# EAGLE board SBECU (EAGLE 9.6.2), part 1 of 2
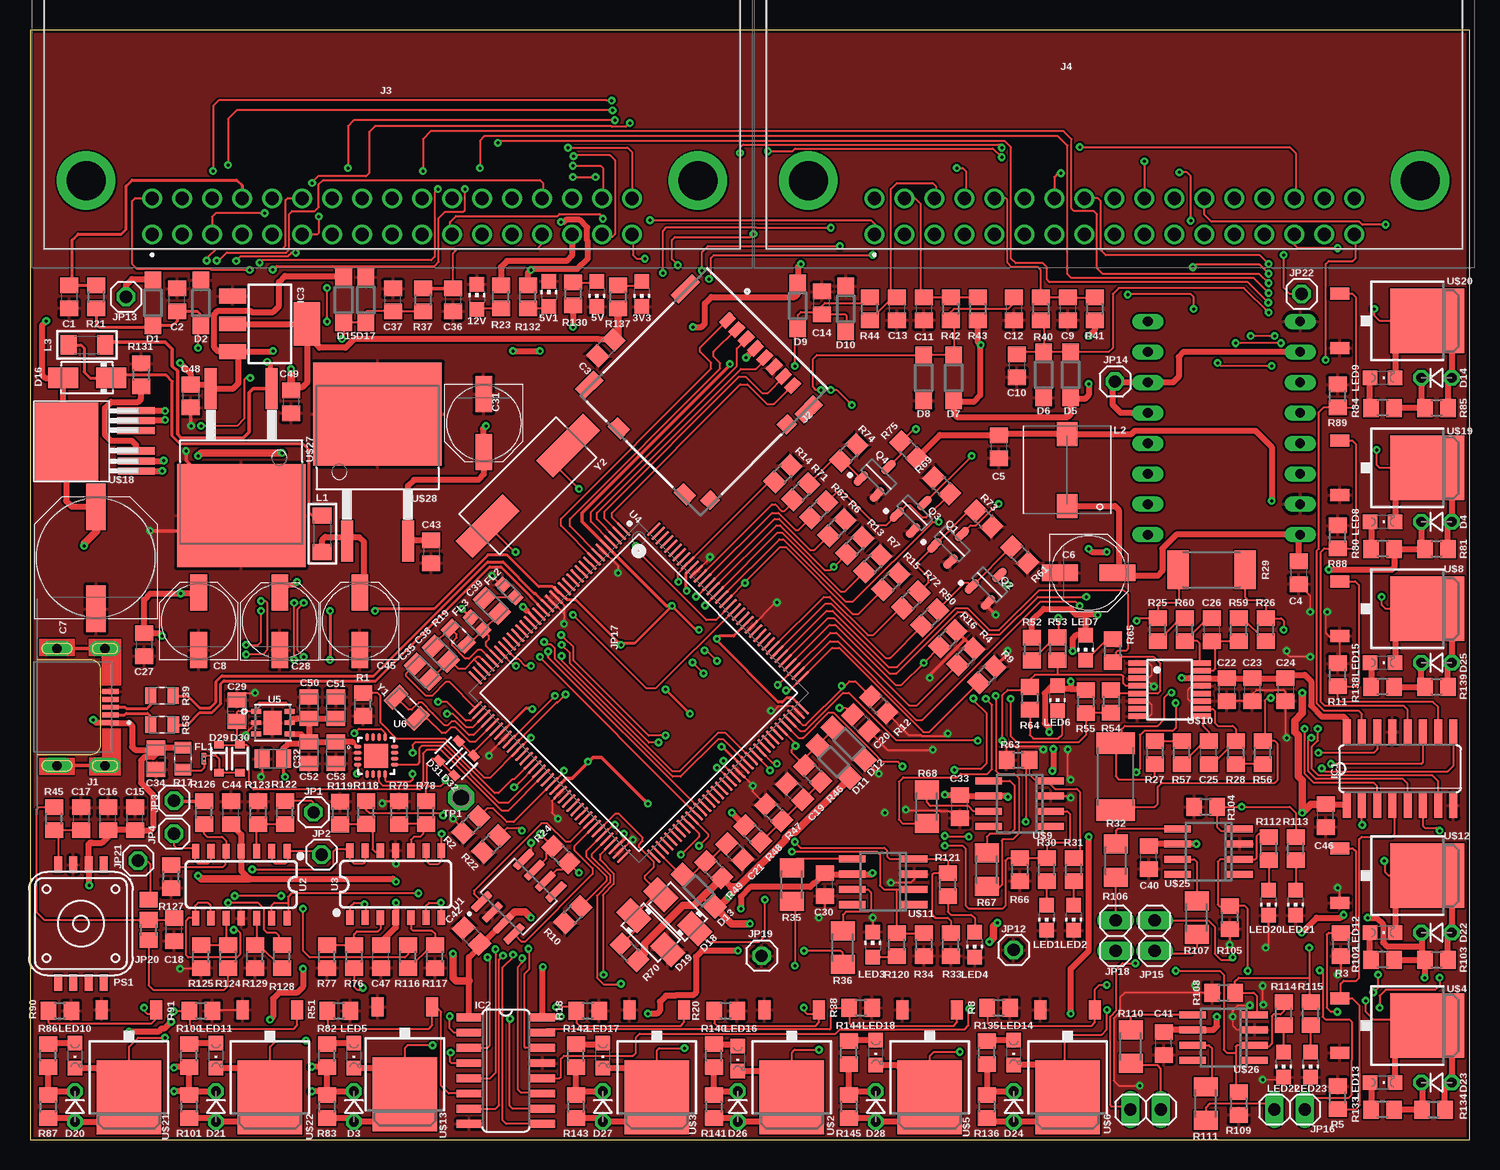
[diagram p5: board, top side]
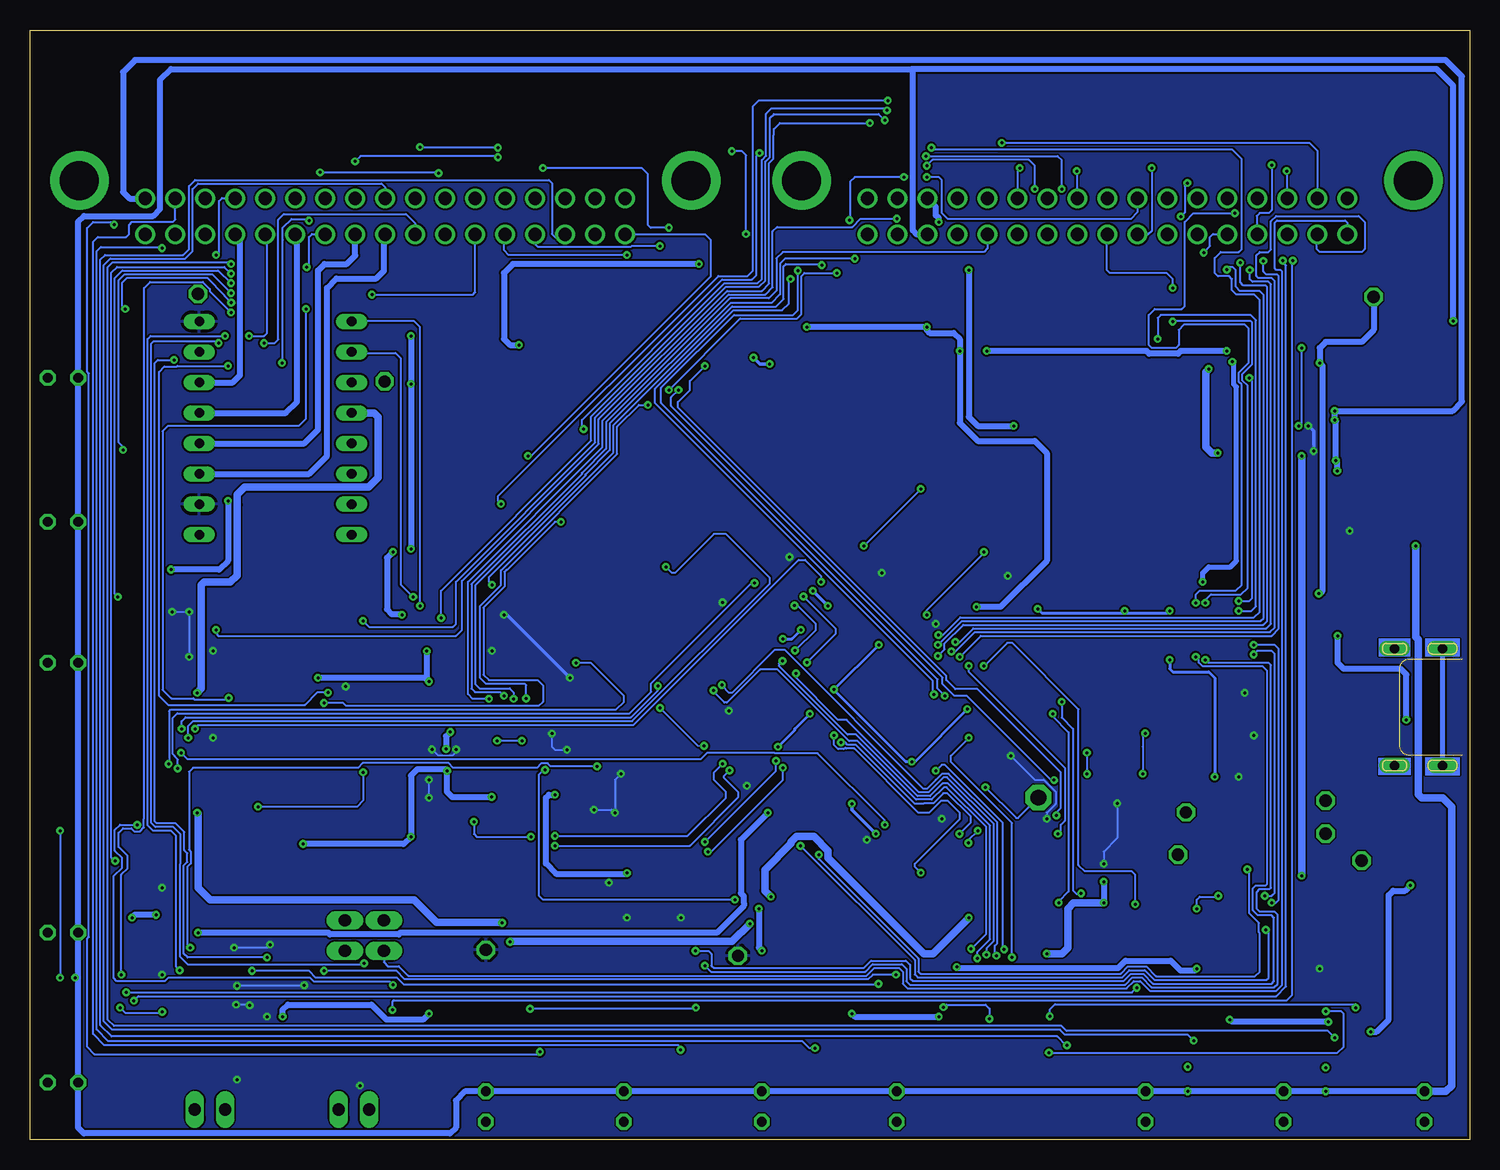
[diagram p6: board, bottom side, seen from below]

Size 120 x 92.5 mm. Coordinates in mm from the lower left corner, seen from the top.
Outline: 0,0 120,0 120,92.5 0,92.5 0,0
Copper layers (1*16): Top 0.035mm / dielectric 1.5mm / Bottom 0.035mm
Design rules "default *": minimum track width 4mil, minimum drill 0.25mm, track to track 6mil, track to pad 6mil, pad to pad 6mil, via to via 6mil, smd to smd 6mil, copper to edge 10mil, drill to drill 6mil, minimum pad ring 10mil, minimum via ring 8mil, stop-mask expansion 4mil, vias tented up to drill 0mil, thermal gap 10mil

## Footprints (pad centres in the part's own frame; a part is rotated, then mirrored left to right if it is on the bottom)
CHIP-LED0805 = smd 1.2 x 1.2: A 0,-1.05; C 0,1.05
C0805 = smd 1.3 x 1.5: 1 -0.95,0; 2 0.95,0
PANASONIC_D = smd 3 x 1.4: + 2.4,0; - -2.4,0
PANASONIC_G = smd 3.9 x 1.6: + 4.25,0; - -4.25,0
CAPC2012X110N = smd 1.24 x 1.56: 1 -0.885,0; 2 0.885,0
CAPC2012X140N = smd 1.24 x 1.56: 1 -0.885,0; 2 0.885,0
CAPC2012X100N = smd 1.24 x 1.56: 1 -0.885,0; 2 0.885,0
SOD123 = smd 1.4 x 1.4: A 1.9,0; C -1.9,0
D-2.5 = drill 0.813 octagon: A 1.27,0; C -1.27,0
DO214AC = smd 2.5 x 1.7: A 2,0; C -2,0
SOD-323 = smd 0.63 x 0.83: A 1.15,0; C -1.15,0
BEADC0603X33N = smd 0.38 x 0.4: 1 -0.281,0; 2 0.281,0
BEADC1608X95N = smd 1 x 0.97: 1 -0.735,0; 2 0.735,0
SO16 = smd 0.66 x 2.032: 1 -4.445,-3.073; 2 -3.175,-3.073; 3 -1.905,-3.073; 4 -0.635,-3.073; 5 0.635,-3.073; 6 1.905,-3.073; 7 3.175,-3.073; 8 4.445,-3.073; 9 4.445,3.073; 10 3.175,3.073; 11 1.905,3.073; 12 0.635,3.073; 13 -0.635,3.073; 14 -1.905,3.073; 15 -3.175,3.073; 16 -4.445,3.073
SOT223 = smd 1.219 x 2.235: 1 -2.311,-3.099; 2 0,-3.099; 3 2.311,-3.099 | smd 3.6 x 2.2: TAB 0,3.099
TE_2134441-2 = smd 1.4 x 0.4: 1 -4.45,1.3; 2 -4.45,0.65; 3 -4.45,0; 4 -4.45,-0.65; 5 -4.45,-1.3 | drill 0.8 pad 1.25 long: S1 -4,-4.875; S2 0,-4.875; S3 0,4.875; S4 -4,4.875
5031821852 = smd 0.8 x 1.24: 1 -2.85,0.63; 2 -1.75,0.63; 3 -0.65,0.63; 4 0.45,0.63; 5 1.55,0.63; 6 2.65,0.63; 7 3.75,0.63; 8 4.85,0.63 | smd 0.95 x 2.5: 9 -7.195,0 | smd 1.15 x 2.2: 10 7.195,0.15; 15 -7.195,-11.33 | smd 1.16 x 1.25: 11 6.795,-2 | smd 1.16 x 1.2: 12 6.74,-11 | smd 1.5 x 1.15: 13 4.89,-12.125; 14 -2.89,-12.125
MX23A34NF1 = drill 1.1 pad 1.65: 1 20,15.5; 2 17.5,15.5; 3 15,15.5; 4 12.5,15.5; 5 10,15.5; 6 7.5,15.5; 7 5,15.5; 8 2.5,15.5; 9 0,15.5; 10 -2.5,15.5; 11 -5,15.5; 12 -7.5,15.5; 13 -10,15.5; 14 -12.5,15.5; 15 -15,15.5; 16 -17.5,15.5; 17 -20,15.5; 18 20,12.5; 19 17.5,12.5; 20 15,12.5; 21 12.5,12.5; 22 10,12.5; 23 7.5,12.5; 24 5,12.5; 25 2.5,12.5; 26 0,12.5; 27 -2.5,12.5; 28 -5,12.5; 29 -7.5,12.5; 30 -10,12.5; 31 -12.5,12.5; 32 -15,12.5; 33 -17.5,12.5; 34 -20,12.5 | drill 3.25 pad 4.875: 35 -25.5,11; 36 25.5,11
1X01 = drill 1.016 octagon: 1 0,0
1X02 = drill 1.016 long: 1 -1.27,0; 2 1.27,0
A0R-JMP = smd 1.5 x 1.3: 1 0,1.7; 2 0,0; 3 0,-1.7
L1206 = smd 1.3 x 1.6: 1 -1.524,0; 2 1.524,0
WE-PD_7332/7345_PLASTIC_BASE = smd 1.7 x 2: 1 0,3; 2 0,-3
CHIPLED_0805 = smd 1.2 x 1.2: A 0,-1.05; C 0,1.05
1317A = smd 1.346 x 0.686: 1 4.915,-1.905; 2 4.915,-0.635; 3 4.915,0.635; 4 4.915,1.905; 5 -4.915,1.905; 6 -4.915,0.635; 7 -4.915,-0.635; 8 -4.915,-1.905
SOT95P280X135-3N = smd 1.4 x 0.65: 1 -1.15,0.95; 2 -1.15,-0.95; 3 1.15,0
R0805 = smd 1.3 x 1.5: 1 -0.95,0; 2 0.95,0
RESC2012X65N = smd 0.97 x 1.38: 1 -0.93,0; 2 0.93,0
RESC2012X60N = smd 0.92 x 1.38: 1 -0.955,0; 2 0.955,0
R2512 = smd 1.8 x 3.2: 1 -2.8,0; 2 2.8,0
M1206 = smd 1.6 x 2: 1 -1.4,0; 2 1.4,0
STEP-STICK = drill 0.8 long: 1A -8.89,-7.62; 1B -8.89,-5.08; 2A -8.89,-2.54; 2B -8.89,0; DIR 3.81,-12.7; EN 3.81,5.08; GND -8.89,-12.7; GNDM -8.89,2.54; MS1 3.81,2.54; MS2 3.81,0; MS3 3.81,-2.54; RST 3.81,-5.08; SLP 3.81,-7.62; SPT 3.81,-10.16; VCC -8.89,-10.16; VMOT -8.89,5.08
P1-13 = drill 1.321 pad 2.159 octagon: TP 0,0
SOIC127P600X175-8N = smd 1.97 x 0.6: 1 -2.475,1.905; 2 -2.475,0.635; 3 -2.475,-0.635; 4 -2.475,-1.905; 5 2.475,-1.905; 6 2.475,-0.635; 7 2.475,0.635; 8 2.475,1.905
SO14 = smd 0.6 x 1.2: 1 -3.175,-2.8; 2 -1.905,-2.8; 3 -0.635,-2.8; 4 0.635,-2.8; 5 1.905,-2.8; 6 3.175,-2.8; 7 4.445,-2.8; 8 4.445,2.8; 9 3.175,2.8; 10 1.905,2.8; 11 0.635,2.8; 12 -0.635,2.8; 13 -1.905,2.8; 14 -3.175,2.8
FREESCALE_SEMICONDUCTOR_MK64FX512VLQ12_0 = smd 1.55 x 0.25: 1 -10.525,8.75; 2 -10.525,8.25; 3 -10.525,7.75; 4 -10.525,7.25; 5 -10.525,6.75; 6 -10.525,6.25; 7 -10.525,5.75; 8 -10.525,5.25; 9 -10.525,4.75; 10 -10.525,4.25; 11 -10.525,3.75; 12 -10.525,3.25; 13 -10.525,2.75; 14 -10.525,2.25; 15 -10.525,1.75; 16 -10.525,1.25; 17 -10.525,0.75; 18 -10.525,0.25; 19 -10.525,-0.25; 20 -10.525,-0.75; 21 -10.525,-1.25; 22 -10.525,-1.75; 23 -10.525,-2.25; 24 -10.525,-2.75; 25 -10.525,-3.25; 26 -10.525,-3.75; 27 -10.525,-4.25; 28 -10.525,-4.75; 29 -10.525,-5.25; 30 -10.525,-5.75; 31 -10.525,-6.25; 32 -10.525,-6.75; 33 -10.525,-7.25; 34 -10.525,-7.75; 35 -10.525,-8.25; 36 -10.525,-8.75; 73 10.525,-8.75; 74 10.525,-8.25; 75 10.525,-7.75; 76 10.525,-7.25; 77 10.525,-6.75; 78 10.525,-6.25; 79 10.525,-5.75; 80 10.525,-5.25; 81 10.525,-4.75; 82 10.525,-4.25; 83 10.525,-3.75; 84 10.525,-3.25; 85 10.525,-2.75; 86 10.525,-2.25; 87 10.525,-1.75; 88 10.525,-1.25; 89 10.525,-0.75; 90 10.525,-0.25; 91 10.525,0.25; 92 10.525,0.75; 93 10.525,1.25; 94 10.525,1.75; 95 10.525,2.25; 96 10.525,2.75; 97 10.525,3.25; 98 10.525,3.75; 99 10.525,4.25; 100 10.525,4.75; 101 10.525,5.25; 102 10.525,5.75; 103 10.525,6.25; 104 10.525,6.75; 105 10.525,7.25; 106 10.525,7.75; 107 10.525,8.25; 108 10.525,8.75 | smd 0.25 x 1.55: 37 -8.75,-10.525; 38 -8.25,-10.525; 39 -7.75,-10.525; 40 -7.25,-10.525; 41 -6.75,-10.525; 42 -6.25,-10.525; 43 -5.75,-10.525; 44 -5.25,-10.525; 45 -4.75,-10.525; 46 -4.25,-10.525; 47 -3.75,-10.525; 48 -3.25,-10.525; 49 -2.75,-10.525; 50 -2.25,-10.525; 51 -1.75,-10.525; 52 -1.25,-10.525; 53 -0.75,-10.525; 54 -0.25,-10.525; 55 0.25,-10.525; 56 0.75,-10.525; 57 1.25,-10.525; 58 1.75,-10.525; 59 2.25,-10.525; 60 2.75,-10.525; 61 3.25,-10.525; 62 3.75,-10.525; 63 4.25,-10.525; 64 4.75,-10.525; 65 5.25,-10.525; 66 5.75,-10.525; 67 6.25,-10.525; 68 6.75,-10.525; 69 7.25,-10.525; 70 7.75,-10.525; 71 8.25,-10.525; 72 8.75,-10.525; 109 8.75,10.525; 110 8.25,10.525; 111 7.75,10.525; 112 7.25,10.525; 113 6.75,10.525; 114 6.25,10.525; 115 5.75,10.525; 116 5.25,10.525; 117 4.75,10.525; 118 4.25,10.525; 119 3.75,10.525; 120 3.25,10.525; 121 2.75,10.525; 122 2.25,10.525; 123 1.75,10.525; 124 1.25,10.525; 125 0.75,10.525; 126 0.25,10.525; 127 -0.25,10.525; 128 -0.75,10.525; 129 -1.25,10.525; 130 -1.75,10.525; 131 -2.25,10.525; 132 -2.75,10.525; 133 -3.25,10.525; 134 -3.75,10.525; 135 -4.25,10.525; 136 -4.75,10.525; 137 -5.25,10.525; 138 -5.75,10.525; 139 -6.25,10.525; 140 -6.75,10.525; 141 -7.25,10.525; 142 -7.75,10.525; 143 -8.25,10.525; 144 -8.75,10.525
DFN300X300X80-7N = smd 0.813 x 0.406: 1 -1.397,0.94; 2 -1.397,0; 3 -1.397,-0.94; 4 1.397,-0.94; 5 1.397,0; 6 1.397,0.94 | smd 1.499 x 2.007: 7 -0.025,-0.025
QFN50P300X300X65-17N = smd 0.65 x 0.3: 1 -1.55,0.75; 2 -1.55,0.25; 3 -1.55,-0.25; 4 -1.55,-0.75; 9 1.55,-0.75; 10 1.55,-0.25; 11 1.55,0.25; 12 1.55,0.75 | smd 0.3 x 0.65: 5 -0.75,-1.55; 6 -0.25,-1.55; 7 0.25,-1.55; 8 0.75,-1.55; 13 0.75,1.55; 14 0.25,1.55; 15 -0.25,1.55; 16 -0.75,1.55 | smd 2 x 2: 17 0,0
DPAK_N-CHANNEL_MOSFET = smd 5.4 x 6.2: D 0,1.23 | smd 1 x 1.6: G -2.28,-6.07; S 2.28,-6.07
SO-8 = smd 0.6 x 2.2: 1 -1.905,-2.6; 2 -0.635,-2.6; 3 0.635,-2.6; 4 1.905,-2.6; 5 1.905,2.6; 6 0.635,2.6; 7 -0.635,2.6; 8 -1.905,2.6
QSOP16 = smd 0.45 x 1.5: 1 -2.223,-2.69; 2 -1.587,-2.69; 3 -0.953,-2.69; 4 -0.318,-2.69; 5 0.318,-2.69; 6 0.953,-2.69; 7 1.587,-2.69; 8 2.223,-2.69; 9 2.223,2.69; 10 1.587,2.69; 11 0.953,2.69; 12 0.318,2.69; 13 -0.318,2.69; 14 -0.953,2.69; 15 -1.587,2.69; 16 -2.223,2.69
VN5R003H-E_HPAK_TO267_7 = smd 0.6 x 3.1: 1 -2.53,1.65; 2 -1.68,1.65; 3 -0.83,1.66; 5 0.85,1.67; 6 1.68,1.67; 7 2.53,1.67 | smd 6.5 x 5.3: 4 -0.05,7.45
TO263-3 = smd 1 x 3.4: 1 -2.54,-6.6; 3 2.54,-6.6 | smd 10.7 x 8.6: TAB 0,4
XTAL_ABS07-32.768KHZ-T = smd 1.1 x 1.9: 1 -1.25,0; 2 1.25,0
XTAL_ECS-160-20-5P-DN-TR = smd 5.5 x 2: 1 -4.75,0; 2 4.75,0

## Placement (x,y rotation side)
3V3  [CHIP-LED0805]  51,70.5 180 top
5V  [CHIP-LED0805]  47.25,70.5 180 top
5V1  [CHIP-LED0805]  43.25,70.5 0 top
12V  [CHIP-LED0805]  37.25,70.25 0 top
C1  100nF  [C0805]  3.25,70.25 270 top
C2  220nF  [C0805]  12.25,70 90 top
C3  100nF  [C0805]  48,66 225 top
C4  100nF 50V  [C0805]  105.75,47.25 270 top
C5  100nF 50V  [C0805]  80.75,57.75 270 top
C6  100uF 35V  [PANASONIC_D]  88.25,47.25 0 top
C7  470uF 50V  [PANASONIC_G]  5.5,48.5 90 top
C8  220uF  [PANASONIC_D]  14.07,43.22 90 top
C9  100nF  [C0805]  86.5,69.25 270 top
C10  220nF  [C0805]  82.25,64.5 270 top
C11  100nF  [C0805]  74.5,69.25 270 top
C12  220nF  [C0805]  82,69.25 270 top
C13  100nF  [C0805]  72.25,69.25 270 top
C14  220nF  [C0805]  66,69.75 90 top
C15  1uF  [C0805]  8.75,26.75 90 top
C16  100nF  [C0805]  6.5,26.75 90 top
C17  100nF  [C0805]  4.25,26.75 270 top
C18  220nF  [C0805]  12,17.5 90 top
C19  100nF  [C0805]  63.75,29 135 top
C20  220nF  [C0805]  69.25,34.75 315 top
C21  4.7nF  [C0805]  58.75,24 315 top
C22  10nF  [C0805]  99.75,37.5 270 top
C23  100nF  [C0805]  101.88,37.5 270 top
C24  1uF  [C0805]  104.66,37.5 270 top
C25  1nF  [C0805]  98.25,32.25 90 top
C26  1nF  [C0805]  98.5,42.5 270 top
C27  1uF  [C0805]  9.5,41.25 270 top
C28  220uF  [PANASONIC_D]  20.83,43.21 90 top
C29  C0805X104K1REC  [CAPC2012X110N]  17.25,35.75 270 top
C30  1uF  [C0805]  66.25,21.25 90 top
C31  220uF  [PANASONIC_D]  37.83,59.73 270 top
C32  C0805X225J4REC  [CAPC2012X140N]  20.25,31.75 180 top
C33  1uF  [C0805]  77.5,27.75 90 top
C34  C0805X225J4REC  [CAPC2012X140N]  10.5,31.75 90 top
C35  C0805X104K1REC  [CAPC2012X110N]  32.75,39 135 top
C36  100nF  [C0805]  35.25,70 270 top
C37  220nF  [C0805]  30.25,70 90 top
C38  C0805X104K1REC  [CAPC2012X110N]  34.25,40.5 135 top
C39  C0805X225J4REC  [CAPC2012X140N]  38.5,44.5 135 top
C40  1uF  [C0805]  93.25,23.5 90 top
C41  1uF  [C0805]  94.5,8 90 top
C42  100nF  [C0805]  36.81,16.96 135 top
C43  1uF  [C0805]  33.45,49 270 top
C44  100nF  [C0805]  16.75,27.25 90 top
C45  220uF  [PANASONIC_D]  27.5,43.22 90 top
C46  100nF  [C0805]  108,27 90 top
C47  100nF  [C0805]  29.25,15.25 90 top
C48  10uF  [C0805]  13.39,61.99 270 top
C49  10uF  [C0805]  21.75,61.5 270 top
C50  C0805X104K1REC  [CAPC2012X110N]  23.25,36 270 top
C51  C0805X103MMGEC  [CAPC2012X100N]  25.5,36 270 top
C52  C0805X103MMGEC  [CAPC2012X100N]  23.25,32.25 90 top
C53  C0805X225J4REC  [CAPC2012X140N]  25.5,32.25 90 top
D1  1N5819HW-7-F  [SOD123]  10.25,69.75 270 top
D2  1N5819HW-7-F  [SOD123]  14.25,69.75 90 top
D3  1N4001  [D-2.5]  27,2.75 270 top
D4  1N4001  [D-2.5]  117.25,51.5 0 top
D5  1N5819HW-7-F  [SOD123]  86.75,63.75 90 top
D6  1N5819HW-7-F  [SOD123]  84.5,63.75 270 top
D7  1N5819HW-7-F  [SOD123]  77,63.5 90 top
D8  1N5819HW-7-F  [SOD123]  74.5,63.5 270 top
D9  1N5819HW-7-F  [SOD123]  64,69.5 270 top
D10  1N5819HW-7-F  [SOD123]  68,69.25 90 top
D11  1N5819  [SOD123]  67,31.5 135 top
D12  1N5819  [SOD123]  68.25,33 315 top
D13  1N5819HW-7-F  [SOD123]  55.75,20.75 135 top
D14  1N4001  [D-2.5]  117.25,63.5 0 top
D15  1N5819HW-7-F  [SOD123]  26.15,70 270 top
D16  B340A 3A  [DO214AC]  4.75,63.5 180 top
D17  1N5819HW-7-F  [SOD123]  28,70 90 top
D18  1N4001 SMA  [DO214AC]  54,19 135 top
D19  1N4001 SMA  [DO214AC]  51.75,17.25 315 top
D20  1N4001  [D-2.5]  3.75,2.75 270 top
D21  1N4001  [D-2.5]  15.5,2.75 270 top
D22  1N4001  [D-2.5]  117.25,17.25 0 top
D23  1N4001  [D-2.5]  117.25,4.75 0 top
D24  1N4001  [D-2.5]  82,2.75 270 top
D25  1N4001  [D-2.5]  117.25,39.75 0 top
D26  1N4001  [D-2.5]  59,2.75 270 top
D27  1N4001  [D-2.5]  47.75,2.75 270 top
D28  1N4001  [D-2.5]  70.5,2.75 270 top
D29  BAT20JFILM  [SOD-323]  15.75,31.75 270 top
D30  BAT20JFILM  [SOD-323]  17.5,31.75 270 top
D31  BAT20JFILM  [SOD-323]  34.92,32.41 225 top
D32  BAT20JFILM  [SOD-323]  36.19,31.17 225 top
FL1  BLM03AX121SN1D  [BEADC0603X33N]  14.5,31.75 90 top
FL2  BLM18DN601SH1D  [BEADC1608X95N]  39.93,45.73 135 top
FL3  BLM18DN601SH1D  [BEADC1608X95N]  37.26,43 135 top
IC1  4504D  [SO16]  114.21,30.92 0 top
IC2  4504D  [SO16]  39.67,5.74 270 top
IC3  LM1117IMPX-3.3  [SOT223]  20,68 270 top
J1  2134441-2  [TE_2134441-2]  2.25,36.05 180 top
J2  503182-1852  [5031821852]  59.71,65.84 315 top
J3  MX23A34NF1  [MX23A34NF1]  30.18,90.95 180 top
J4  MX23A34NF1  [MX23A34NF1]  90.39,90.95 180 top
JP1  [1X01]  23.64,27.28 0 top
JP2  [1X01]  24.3,23.75 0 top
JP3  [1X01]  12,28.25 0 top
JP4  [1X01]  12,25.5 0 top
JP12  [1X01]  82,15.8 0 top
JP13  [1X01]  8,70.25 0 top
JP14  [1X01]  90.44,63.2 0 top
JP15  [1X02]  93.75,17 90 top
JP16  [1X02]  105,2.5 0 top
JP17  [1X02]  93,2.5 0 top
JP18  [1X02]  90.5,17 90 top
JP19  [1X01]  60.99,15.31 0 top
JP20  0R-JUMPA  [A0R-JMP]  9.89,18.31 180 top
JP21  [1X01]  9,23.25 0 top
JP22  [1X01]  106,70.5 0 top
L1  600R 2A  [L1206]  24.36,50.5 90 top
L2  8.2uH 2.7A  [WE-PD_7332/7345_PLASTIC_BASE]  86.44,55.82 180 top
L3  600R 2A  [L1206]  4.75,66.25 180 top
LED1  [CHIP-LED0805]  84.75,18.5 180 top
LED2  [CHIP-LED0805]  87,18.5 180 top
LED3  [CHIP-LED0805]  70.25,16.25 0 top
LED4  [CHIP-LED0805]  78.75,16.25 180 top
LED5  [CHIPLED_0805]  27,7 180 top
LED6  [CHIP-LED0805]  85.65,36.79 180 top
LED7  [CHIP-LED0805]  88,41 180 top
LED8  [CHIPLED_0805]  112.75,51.5 270 top
LED9  [CHIPLED_0805]  112.75,63.5 270 top
LED10  [CHIPLED_0805]  3.75,7 180 top
LED11  [CHIPLED_0805]  15.5,7 180 top
LED12  [CHIPLED_0805]  112.75,17.25 270 top
LED13  [CHIPLED_0805]  112.75,4.75 270 top
LED14  [CHIPLED_0805]  82,7.25 180 top
LED15  [CHIPLED_0805]  112.75,39.75 270 top
LED16  [CHIPLED_0805]  59,6.75 180 top
LED17  [CHIPLED_0805]  47.75,7 180 top
LED18  [CHIPLED_0805]  70.5,7.25 180 top
LED20  [CHIP-LED0805]  103.25,19.75 180 top
LED21  [CHIP-LED0805]  105.5,19.75 180 top
LED22  [CHIP-LED0805]  104.5,6.25 180 top
LED23  [CHIP-LED0805]  106.75,6.25 180 top
PS1  MPXH6400AC6T1  [1317A]  4.25,18 90 top
Q1  IRLML0030TRPBF  [SOT95P280X135-3N]  76.88,49.67 45 top
Q2  IRLML0030TRPBF  [SOT95P280X135-3N]  80,46.25 45 top
Q3  IRLML0030TRPBF  [SOT95P280X135-3N]  73.75,52.25 45 top
Q4  IRLML0030TRPBF  [SOT95P280X135-3N]  70.75,55.25 45 top
R1  10K  [R0805]  27.75,36.26 90 top
R2  10K  [R0805]  36.75,26.25 45 top
R3  68K  [R0805]  109.26,16.25 270 top
R4  10K  [R0805]  78,40.25 225 top
R5  68K  [R0805]  109,3.5 90 top
R6  10K  [R0805]  67.25,51 225 top
R7  10K  [R0805]  70.25,48 225 top
R8  68K  [R0805]  80.75,11 0 top
R9  10K  [R0805]  79.75,38.75 225 top
R10  10K  [R0805]  45.25,18.75 45 top
R11  68K  [R0805]  109,38.75 90 top
R12  10K  [R0805]  70.75,36.25 135 top
R13  10K  [R0805]  68.75,49.5 225 top
R14  10K  [R0805]  62.75,55.5 225 top
R15  10K  [R0805]  71.75,46.5 225 top
R16  10K  [R0805]  76.5,41.75 225 top
R17  PICOSMDC050S-2  [RESC2012X65N]  12.75,31.75 90 top
R18  68K  [R0805]  46.5,10.75 0 top
R19  SR0805MR-7W470RL  [RESC2012X60N]  35.72,41.97 315 top
R20  68K  [R0805]  58,10.75 0 top
R21  470R  [R0805]  5.5,70.25 270 top
R22  10K  [R0805]  38.44,24.64 225 top
R23  2K7  [R0805]  39.25,70.25 90 top
R24  120R  [R0805]  44.25,23.75 135 top
R25  5K  [R0805]  94,42.5 90 top
R26  5K  [R0805]  103,42.5 90 top
R27  5K  [R0805]  93.75,32.25 270 top
R28  5K  [R0805]  100.5,32.25 270 top
R29  4K7 3W  [R2512]  98.5,47.5 0 top
R30  470R  [R0805]  84.75,22.5 90 top
R31  470R  [R0805]  87,22.5 90 top
R32  4K7 3W  [R2512]  90.5,30.25 90 top
R33  100K  [R0805]  76.75,16.25 90 top
R34  100K  [R0805]  74.5,16.25 270 top
R35  22R  [M1206]  63.5,21.25 270 top
R36  22R  [M1206]  67.75,16 270 top
R37  470R  [R0805]  32.75,70 270 top
R38  68K  [R0805]  69.25,11 0 top
R39  SR0805MR-0733RL  [RESC2012X60N]  11,37 0 top
R40  470R  [R0805]  84.25,69.25 270 top
R41  2K49  [R0805]  88.75,69.25 270 top
R42  470R  [R0805]  76.75,69.25 270 top
R43  2K49  [R0805]  79,69.25 270 top
R44  470R  [R0805]  70,69.25 90 top
R45  470R  [R0805]  2,26.75 90 top
R46  470R  [R0805]  65.25,30.5 135 top
R47  1K  [R0805]  62,27.25 315 top
R48  3K9  [R0805]  60.25,25.5 135 top
R49  1K  [R0805]  57,22.5 135 top
R50  100R  [R0805]  75,43.5 225 top
R51  68K  [R0805]  25.75,10.75 0 top
R52  10K  [R0805]  83.54,40.88 270 top
R53  1K  [R0805]  85.66,40.9 270 top
R54  1K  [R0805]  90.12,36.52 270 top
R55  10K  [R0805]  88,36.5 270 top
R56  5K  [R0805]  102.75,32.25 90 top
R57  5K  [R0805]  96,32.25 90 top
R58  SR0805MR-0733RL  [RESC2012X60N]  11,34.58 0 top
R59  5K  [R0805]  100.75,42.5 90 top
R60  5K  [R0805]  96.25,42.5 90 top
R61  47K  [R0805]  82.5,48.75 315 top
R62  100R  [R0805]  65.75,52.5 225 top
R63  100K  [R0805]  82.36,31.64 0 top
R64  10K  [R0805]  83.34,36.78 270 top
R65  10K  [R0805]  90.25,40.75 90 top
R66  100K  [R0805]  82.5,22.5 270 top
R67  22R  [M1206]  79.75,22.5 270 top
R68  22R  [M1206]  74.75,27.75 270 top
R69  47K  [R0805]  76,54.5 135 top
R70  2,2K  [R0805]  49.97,15.61 315 top
R71  100R  [R0805]  64.25,54 225 top
R72  100R  [R0805]  73.43,44.98 225 top
R73  47K  [R0805]  79.5,51.75 315 top
R74  47K  [R0805]  68.25,57.25 45 top
R75  10K  [R0805]  73.25,57.5 315 top
R76  180K +/-0.1%  [R0805]  27,15.25 270 top
R77  330K +/-0.1%  [R0805]  24.75,15.25 90 top
R78  180K +/-0.1%  [R0805]  33,27.25 90 top
R79  330K +/-0.1%  [R0805]  30.75,27.25 270 top
R80  2K7  [R0805]  112.75,49.25 180 top
R81  1K  [R0805]  117.25,49.25 0 top
R82  2K7  [R0805]  24.75,7 90 top
R83  1K  [R0805]  24.75,2.75 270 top
R84  2K7  [R0805]  112.75,61 180 top
R85  1K  [R0805]  117.25,61 0 top
R86  2K7  [R0805]  1.5,7 90 top
R87  1K  [R0805]  1.5,2.75 270 top
R88  68K  [R0805]  109,50.25 90 top
R89  68K  [R0805]  109,62 90 top
R90  68K  [R0805]  2.5,10.75 0 top
R91  68K  [R0805]  14.25,10.75 0 top
R100  2K7  [R0805]  13.25,7 90 top
R101  1K  [R0805]  13.25,2.75 270 top
R102  2K7  [R0805]  112.75,15 180 top
R103  1K  [R0805]  117.25,15 0 top
R104  100K  [R0805]  98,27.75 0 top
R105  100K  [R0805]  100,18.5 270 top
R106  22R  [M1206]  90.5,23.25 270 top
R107  22R  [M1206]  97.25,18.5 270 top
R108  100K  [R0805]  99.5,12.25 0 top
R109  100K  [R0805]  100.75,3 270 top
R110  22R  [M1206]  91.75,7.75 270 top
R111  22R  [M1206]  98,3 270 top
R112  470R  [R0805]  103.25,24.25 90 top
R113  470R  [R0805]  105.5,24.25 90 top
R114  470R  [R0805]  104.5,10.5 90 top
R115  470R  [R0805]  106.75,10.5 90 top
R116  180K +/-0.1%  [R0805]  31.5,15.25 90 top
R117  330K +/-0.1%  [R0805]  33.75,15.25 90 top
R118  180K +/-0.1%  [R0805]  28.02,27.26 90 top
R119  330K +/-0.1%  [R0805]  25.85,27.23 270 top
R120  470R  [R0805]  72.25,16.25 90 top
R121  470R  [R0805]  76.5,21.25 90 top
R122  180K +/-0.1%  [R0805]  21.25,27.25 90 top
R123  330K +/-0.1%  [R0805]  19,27.25 270 top
R124  180K +/-0.1%  [R0805]  16.5,15.25 270 top
R125  330K +/-0.1%  [R0805]  14.25,15.25 90 top
R126  180K +/-0.1%  [R0805]  14.5,27.25 90 top
R127  330K +/-0.1%  [R0805]  11.76,21.92 90 top
R128  180K +/-0.1%  [R0805]  21,15.25 90 top
R129  330K +/-0.1%  [R0805]  18.75,15.25 90 top
R130  560R  [R0805]  45.25,70.5 270 top
R131  100R  [R0805]  9.25,63.75 270 top
R132  560R  [R0805]  41.5,70.25 90 top
R133  2K7  [R0805]  112.75,2.5 180 top
R134  1K  [R0805]  117,2.5 0 top
R135  2K7  [R0805]  79.75,7.25 90 top
R136  1K  [R0805]  79.75,2.75 270 top
R137  470R  [R0805]  49,70.25 270 top
R138  2K7  [R0805]  112.75,37.75 180 top
R139  1K  [R0805]  117.25,37.75 0 top
R140  2K7  [R0805]  57,7 90 top
R141  1K  [R0805]  57,2.75 270 top
R142  2K7  [R0805]  45.5,7 90 top
R143  1K  [R0805]  45.5,2.75 270 top
R144  2K7  [R0805]  68.25,7.25 90 top
R145  1K  [R0805]  68.25,2.75 270 top
STEPSTICK-X  STEP-STICK  [STEP-STICK]  97,55.5 180 top
TP1  PTR1PAD1-13  [P1-13]  35.94,28.5 0 top
U1  SN65HVD230QDR  [SOIC127P600X175-8N]  40.75,20.25 45 top
U2  LMV324  [SO14]  18.25,21.25 180 top
U3  LMV324  [SO14]  29.85,21.29 0 top
U4  FREESCALE_SEMICONDUCTOR_MK64FX512VLQ12FREESCALE_SEMICONDUCTOR_MK64FX512VLQ12_0_0  [FREESCALE_SEMICONDUCTOR_MK64FX512VLQ12_0]  50.75,37.25 315 top
U5  LP38691SD-ADJ  [DFN300X300X80-7N]  20.25,34.75 0 top
U6  MKL02Z32VFG4  [QFN50P300X300X65-17N]  28.86,32 0 top
U$2  DPAK_N-CHANNEL_MOSFET  [DPAK_N-CHANNEL_MOSFET]  63.5,4.75 180 top
U$3  DPAK_N-CHANNEL_MOSFET  [DPAK_N-CHANNEL_MOSFET]  52.25,4.75 180 top
U$4  DPAK_N-CHANNEL_MOSFET  [DPAK_N-CHANNEL_MOSFET]  115.25,9.5 270 top
U$5  DPAK_N-CHANNEL_MOSFET  [DPAK_N-CHANNEL_MOSFET]  75,4.75 180 top
U$6  DPAK_N-CHANNEL_MOSFET  [DPAK_N-CHANNEL_MOSFET]  86.5,4.75 180 top
U$8  DPAK_N-CHANNEL_MOSFET  [DPAK_N-CHANNEL_MOSFET]  115.25,44.25 270 top
U$9  TC427SO-8  [SO-8]  82.5,28 90 top
U$10  MAX9926  [QSOP16]  95,37.5 270 top
U$11  TC427SO-8  [SO-8]  71.13,21.49 90 top
U$12  DPAK_N-CHANNEL_MOSFET  [DPAK_N-CHANNEL_MOSFET]  115.25,22 270 top
U$13  DPAK_N-CHANNEL_MOSFET  [DPAK_N-CHANNEL_MOSFET]  31.25,5 180 top
U$18  VN5R003H-E  [VN5R003H-E_HPAK_TO267_7]  10.5,58.25 90 top
U$19  DPAK_N-CHANNEL_MOSFET  [DPAK_N-CHANNEL_MOSFET]  115.25,56 270 top
U$20  DPAK_N-CHANNEL_MOSFET  [DPAK_N-CHANNEL_MOSFET]  115.25,68.25 270 top
U$21  DPAK_N-CHANNEL_MOSFET  [DPAK_N-CHANNEL_MOSFET]  8.25,4.75 180 top
U$22  DPAK_N-CHANNEL_MOSFET  [DPAK_N-CHANNEL_MOSFET]  20,4.75 180 top
U$25  TC427SO-8  [SO-8]  98.25,24 90 top
U$26  TC427SO-8  [SO-8]  99.5,8.5 90 top
U$27  MIC29301-5.0WU-TR  [TO263-3]  17.61,56.01 180 top
U$28  MIC29301-5.0WU-TR  [TO263-3]  28.96,56.49 0 top
Y1  ABS07-32.768KHZ-T  [XTAL_ABS07-32.768KHZ-T]  31.41,35.99 315 top
Y2  ECS-160-20-5P-DN-TR  [XTAL_ECS-160-20-5P-DN-TR]  41.5,54.5 225 top

## Tracks (layer width: path | path; a pad name or v marks a point on that pad's centre or on a via)
3.3V  (via drill 0.25)
  Top 0.254: U4.135 55.19,47.69 54.66,47.16 54.66,45.83 v54.75,45.75 | U4.122 58.65,41.97 57.47,41.97 v57.25,41.75 57.25,41.59 62.36,36.47 62.73,36.47 63.08,36.82 63.55,36.82 U4.108 | v55.75,42.5 55.5,42.5 v53.5,44.5 50.38,41.38 49.12,41.38 | U4.94 57.73,32.75 v57.65,32.75 | v55,35.5 v52.98,37.52 | v49.25,41.25 49.12,41.38 | 49.12,41.38 45.5,45 44.75,45 44.19,45.56 U4.16 44.06,45.58 43.55,46.09 42.41,46.09 39.75,48.75 38.17,48.75 33.67,44.25 28.92,44.25 v28.75,44.08 | U4.43 41.37,36 41.75,36 v41.87,35.88 | FL3.2 v36.01,44.25 v36,44.25 | v25,44.08 v25,40 | v21.25,30.25 21.14,30.36 C32.1
  Top 0.305: v58.34,64.66 58.34,64.55 46.02,52.23 46.02,51.53 U4.5 53.05,44.5 v53.5,44.5 | v59.67,65.21 v59.67,65.2 | U4.70 49.5,25.04 v49.5,25.5 | v51.5,28 47.65,31.85 46.92,31.85 46.57,31.5 v46.5,31.5 46.5,31.43 45.18,30.12 44.68,30.12 U4.56 | U6.1 26.92,33.13
  Top 0.508: C52.2 23.11,33 21.5,33 21.14,32.63 C32.1 | U5.4 22.57,33.81 C52.2 | C50.2 C52.2 | U5.5 21.98,35.08 22.22,35.08 22.26,35.12 C50.2 | C50.2 C51.2 | C52.2 C53.2 26.92,33.13 | J2.4 59.72,65.21 v59.67,65.21
  Bottom 0.254: v57.25,41.75 56.5,41.75 v55.75,42.5 | v57.65,32.75 56.25,34.15 56.25,34.25 v55,35.5 | v49.25,41.25 v52.98,37.52 52.98,37.48 47,31.5 v46.5,31.5 46.25,31.5 v41.87,35.88 | v36,44.25 35.63,43.88 28.75,43.88 | v25,44.08 25.2,43.88 28.75,43.88 | v25,40 25,39.25 24.75,39 21.75,39 21.25,38.5 v21.25,30.25 | v28.75,44.08 28.75,43.88
  Bottom 0.305: v58.34,64.66 59.13,64.66 v59.67,65.2 | v53.5,44.5 v54.75,45.75 | v49.5,25.5 51.5,27.5 v51.5,28
+3V3  (via drill 0.25)
  Top 0.254: R49.1 56.05,20.2 56.84,19.41 D13.C | 50.85,15.15 R70.2
  Top 0.508: IC3.2 IC3.TAB 23.25,68 23.14,67.89 23.14,67 | C49.1 22.05,62.75 22.74,62.75 23.14,63.16 23.14,67 | C44.1 17.61,25.43 U2.4 17.61,22.39 18.25,21.75 30.25,21.75 v30.5,21.5 | C47.2 29.35,16.3 29.35,16.55 30.48,17.69 U3.4 30.5,18.51 v30.5,19.75 | U1.3 37.48,16.09 36.6,15.2 36.6,13.25 IC2.1 | 90.52,63.12 STEPSTICK-X.SLP 95.28,63.12 95.75,63.59 95.75,65.25 96.16,65.66 STEPSTICK-X.VCC | 90.52,63.12 JP14.1 | STEPSTICK-X.RST 90.92,60.58 90.25,61.25 90.25,62.85 90.52,63.12 | C46.2 109.66,27.95 IC1.1 | C3.1 47.48,66.67 47.43,66.72 27.01,66.72 26.3,66.02 24.13,66.02 23.14,67 | 58.45,21.05 R49.1 | v58.25,20.25 59.04,21.04 59.04,21.05
  Top 0.61: R137.2 49,67 C3.1 | 18.25,21.75 14.25,21.75 v14,22 | v14,57 14.25,57.25 v21,57.25 | v21.75,64.25 C49.1 | 36.6,13.25 35.5,13.25 35.25,13.5 v35.25,15.5 | U1.3 40.4,19 41.25,19 v41.75,18.5 | v58.25,20.25 57.41,19.41 D13.C 58.5,18 v60,18 | R49.1 55.37,19.53 54.44,19.53 51.22,16.31 51.22,15.52 50.85,15.15 | D11.C 63.78,25.59 63.42,25.59 62.97,25.13 62.97,24.97 59.04,21.05 58.45,21.05 | v79.99,16.48 80.32,16.8 80.32,17.77 v80.63,18.07 | C46.2 106.76,27.95 v106.06,27.25 106.06,29.94 105.72,30.28 105.72,33.67 105.42,33.97 105.42,34.9 106.07,35.55 v106.07,37.25
  Top 0.813: C42.1 37.48,16.09
  Bottom 0.508: v30.5,21.5 v30.5,19.75
  Bottom 0.61: v14,22 v14,57 | v21,57.25 21.5,57.25 22,57.75 22,64 v21.75,64.25 | v30.5,19.75 32.04,19.75 32.05,19.73 33.02,19.73 33.5,19.25 33.5,16 34,15.5 v35.25,15.5 | v41.75,18.5 44.75,15.5 45.5,15.5 53.47,23.46 53.47,24.07 54.66,25.27 56.09,25.27 56.55,24.81 56.55,24.7 58.75,22.5 58.75,20.75 v58.25,20.25 | v79.99,16.48 79.97,16.5 61.5,16.5 v60,18 | v80.63,18.07 80.63,18.11 86.11,18.11 88,20 105,20 106,21 106,27.19 v106.06,27.25 | v106.07,37.25 105.71,37.61 105.71,46.24 105.48,46.47 103.3,46.47 102.75,47.02 102.75,52.89 102.72,52.92 102.72,53.78 102.11,54.39 91.78,54.39 91,55.17 91,60.25 91.33,60.58 STEPSTICK-X.RST
+5V  (via drill 0.25)
  Top 0.305: 41.43,44.09 U4.22
  Top 0.508: JP13.1 8,71.25 8.5,71.75 10.15,71.75 D1.C | v12.5,64.75 13.39,63.86 C48.1 14.74,62.94 U$27.3 16.95,62.61 17.38,63.05 17.38,65.21 IC3.3 | C8.+ 13.96,45.52 v12.57,45.52 10.02,45.52 9.5,45 C27.1 10.8,42.2 v11,42 | C34.2 10.37,32.5 8.75,32.5 8.5,32.75 8.5,34.5 8.25,34.75 J1.1 5.52,34.75 v5.27,35 | R17.2 12.71,32.63 C34.2 | C34.2 10.5,32.14 10.25,31.89 9.55,31.89 9.25,31.59 9.25,29.75 10.25,28.75 10.25,26 10,25.75 8.8,25.75 C15.1 C16.1 6.5,25.25 6,24.75 5.17,24.75 5.17,24.74 5,24.74 4.88,24.63 PS1.2 4.88,21.23 v4.93,21.19 | IC3.3 15.7,65.69 15.36,66.03 15.36,68.79 15.66,69.09 18.36,69.09 18.45,69 20.25,69 20.75,69.5 20.75,71.48 21.25,71.98 26.07,71.98 D15.C | v64.25,73 64,72.75 D9.C 64,70.5 63.75,70.25 56.81,70.25 56.25,69.69 56.25,68.02 55.98,67.75 v55.25,67.75 | R43.2 79,66.5 v79.25,66.25 79.2,66.2 79.2,62.03 78.67,61.5 77.1,61.5 D7.C 77,60.5 77.25,60.25 86.5,60.25 86.75,60.5 86.75,61.75 | C40.2 93.44,24.64 U$25.6 v97.23,24.64 v97.24,24.64 | C41.2 94.69,9.13 U$26.6 98.64,9.13 98.94,9.44 v98.94,10.25 | R130.2 v45.25,67.75 | v41.09,44.41 | v41.09,44.41 41.41,44.09 41.43,44.09 | IC3.3 20.19,65.69 v20.25,65.75 | v40.25,65.75 v42.5,65.75 | 86.75,61.75 D5.C | R41.2 88.75,67.5 v88.25,67 | v88.25,63 88.25,62.08 87.92,61.75 86.75,61.75 | v88.25,49.25 88.5,49 v89.75,49 | R52.1 83.54,43.29 84.5,44.25 86.71,44.25 87.2,43.77 88,43.77 | v89,43.75 88.98,43.77 88,43.77 | 88,43.77 LED7.A 87.21,42.05 86.91,41.75 86.91,40.72 v86.92,40.71 | 86.75,37.55 85.94,37.55 LED6.A 85.25,37.84 84.6,37.19 84.6,34.7 84.94,34.37 84.94,34.01 v84.96,33.99 | 86.75,37.55 87.9,37.55 R55.1
  Top 0.508: v86.75,38.19 86.75,37.55 | v96,38.5 96.73,38.5 96.77,38.46 U$10.14 C22.1 C23.1 C24.1 104.96,38.75 106.25,38.75 106.8,38.2 106.8,36.17 107.7,35.27 109.48,35.27 109.77,34.98 IC1.16 | v85.32,32.55 85.32,30.82 v85.24,30.74 | v81.51,28.55 81.43,28.63 U$9.6 79.89,28.62 77.58,28.62 C33.2 76.3,28.7 v76.25,28.75 | v59.25,19.25 59.25,20.25 60.06,21.06 65.03,21.06 65.33,21.36 65.41,21.36 C30.2 66.33,22.12 U$11.6 70.24,22.12 v70.24,22.21 | v59,15.75 56,15.75 55.5,15.25 55.5,12.25 55.28,12.03 53.86,12.03 53.84,12 53,12 52.5,11.5 52.5,10.75 52.25,10.5 v51.5,10.5 | v44.25,10.25 44.19,10.19 IC2.16 v42.74,14.37 v42.75,14.38 | v22.75,14.25 22.75,12.75 22.25,12.25 20.75,12.25 20.25,11.75 20.25,10.25 v20,10 | v11.76,9.81 11.18,9.23 10.95,9.23 10.71,9 v8.25,9 | v86.75,10.5 86.75,14.25 88.25,15.75 v88.25,25.25
  Bottom 0.508: JP13.1 8,67.5 9,66.5 12,66.5 12.5,66 v12.5,64.75 12.25,64.5 12.25,45.75 12.48,45.52 v12.57,45.52 | v64.25,73 79.75,73 80.5,72.25 80.5,66.75 80,66.25 v79.25,66.25 | v41.09,44.41 39.09,44.41 35.25,48.25 35.25,57.25 36.25,58.25 41,58.25 42.5,59.75 v42.5,65.75 42.5,66.73 43.02,67.25 45.01,67.25 45.25,67.49 v45.25,67.75 v55.25,67.75 | v5.27,35 5.27,38.77 5.75,39.25 10.5,39.25 11,39.75 v11,42 | v20.25,65.75 24.07,65.75 24.3,65.52 26.7,65.52 26.93,65.75 v40.25,65.75 | v88.25,67 v88.25,63 v88.25,49.25 | v89.75,49 90.25,48.5 90.25,44.21 89.85,43.81 89.06,43.81 v89,43.75 | v86.92,40.71 86.92,38.36 v86.75,38.19 87.06,38.5 v96,38.5 | v84.96,33.99 84.96,33.97 85.32,33.6 v85.32,32.56 v85.32,32.55 | v81.51,28.55 84.81,28.55 85.26,29.01 85.26,30.74 v85.24,30.74 85.39,30.89 87.69,30.89 88.25,30.34 v88.25,25.25 88.86,24.64 v97.24,24.64 | v59.25,19.25 59.25,16 v59,15.75 | v51.5,10.5 51.25,10.25 v44.25,10.25 | v42.75,14.38 42.68,14.3 29.28,14.3 28.69,14.9 24.9,14.9 24.09,14.09 22.91,14.09 v22.75,14.25 | v20,10 19.86,9.86 11.8,9.86 v11.76,9.81 | v8.25,9 7.75,9 6.75,10 6.75,20.38 6.38,20.75 5.37,20.75 v4.93,21.19 | v70.24,22.21 70.24,22.17 70.26,22.15 76.15,22.15 77,23 77,28.5 76.75,28.75 v76.25,28.75 | v98.94,10.25 98.94,10.81 98.5,11.25 91.54,11.25 90.3,10.02 87.27,10.02 87.25,10 v86.75,10.5
+5V_2  (via drill 0.25)
  Top 0.508: C43.1 31.57,49.95 U$28.3 31.49,49.91 31.49,54.49 32,55 37.38,55 37.83,55.45 37.83,57 | C31.+ 37.83,57 | R132.2 41.5,72.25 v41.75,72.5 41.84,72.59 45.64,72.59 46.5,73.45 46.5,74.89 46.45,74.94 46.45,76.04 45.8,76.68 44.67,76.68 44.49,76.5 v44.25,76.5 | v38,59.5 37.75,59.25 37.75,57.08 37.83,57
  Bottom 0.508: v41.75,72.5 41.75,60.25 41,59.5 v38,59.5 | v44.25,76.5 44.25,76.82 44.48,77.05 44.48,77.75 J3.32
+12V  (via drill 0.25)
  Top 0.508: C7.+ 3.5,52.75 3,53.25 3,57 3.05,57.05 U$18.4 2.75,58.5 D16.A 1.25,63.5 1,63.75 1,67.88 v1.37,68.25 | J3.15 45.18,73.68 44.75,73.25 39.75,73.25 39.25,72.75 R23.2 | R87.1 1.5,4 | 1.5,4 R86.1 | D20.C 3.73,4 1.5,4 | R101.1 13.57,4.02 D21.C | R101.1 R100.1 12.05,6.05 v12,6 | R83.1 25.07,4.02 D3.C | R83.1 R82.1 v23.5,6.05 | D27.C 45.82,4.02 R143.1 R142.1 | D26.C 57.32,4.02 R141.1 R140.1 | D28.C 68.57,4.02 R145.1 R144.1 | D24.C 80.07,4.02 R136.1 R135.1 | R133.1 R134.1 116.05,4.68 D23.C | R103.1 116,15 116,16.25 | D22.C 116,17.23 116,16.25 | R138.1 R139.1 115.98,38.07 D25.C | R103.1 116.25,14.95 v116.25,13.5 | R101.1 12.93,4.02 v12,4.02 | R83.1 24.43,4.02 v23.5,4.02 | D4.C 115.98,49.57 R81.1 R80.1 113.75,49.2 113.75,47.75 113.51,47.51 v108.25,47.51 | R85.1 115.75,61 | 115.75,61 R84.1 | D14.C 115.98,61.23 115.75,61 | 81,58.82 L2.2 91.82,58.82 92.1,59.1 102.15,59.1 103.5,57.75 v103.5,53.25 | 81,58.82 80.87,58.82 C5.1 | R48.2 v58.5,27.25 | v58.5,27.25 | v106,17.25 107.25,18.5 109.26,18.5 v109.5,18.74 | v111.5,18.5 112.22,18.5 112.79,17.93 112.79,16.42 113.09,16.12 115.88,16.12 116,16.25 | R75.2 75.84,58.75 80.93,58.75 81,58.82 | R102.1 R103.1
  Top 0.61: v4.5,49.5 4.5,49.67 5.56,50.73 5.56,52.69 C7.+
  Bottom 0.508: v1.37,68.25 1.37,87.87 2.75,89.25 46.5,89.25 | J3.15 46.06,75.45 46.41,75.8 46.41,89.16 46.5,89.25 | D20.C v12,4.02 D21.C v23.5,4.02 D3.C D27.C D26.C D28.C D24.C 83.73,4.02 84.5,3.25 84.5,1 84.99,0.51 115.51,0.51 116,1 116,4.73 D23.C D22.C D25.C D4.C D14.C 115.98,76.52 115.5,77 109.75,77 109.15,77.6 109.15,88.35 108.25,89.25 46.5,89.25 | v58.5,27.25 60.75,25 60.75,20.54 60.52,20.3 60.52,19.77 60.5,19.75 60.5,19.5 62.75,17.25 89.11,17.25 89.25,17.1 95,17.1 95.14,17.25 v106,17.25 | v109.5,18.74 111.26,18.74 v111.5,18.5 | v108.25,47.51 104.24,47.51 103.5,48.25 v103.5,53.25
  Bottom 0.61: D20.C 1.98,4.02 1.5,4.5 1.5,27.75 2.25,28.5 4,28.5 4.27,28.77 4.27,41.68 4.5,41.91 v4.5,49.5
BOOST  (via drill 0.25)
  Top 0.152: U$13.D 31.25,7.63 31.48,7.86 33.55,7.86 v33.55,7.85
  Top 0.508: LED5.C 29.07,5.95 U$13.D 28.96,1.48 D3.A 26.68,1.8 R83.2
  Bottom 0.152: v33.55,7.85 33.63,7.85 34.37,8.59 113.2,8.59 114.14,9.53 114.14,73.36 113.75,73.75 107.25,73.75 106.75,74.25 106.75,79.5 106.25,80 76.75,80 76.5,79.75 76.5,75.5 76.25,75.25 75.59,75.25 J4.3
BOOST_CPU  (via drill 0.25)
  Top 0.152: R4.2 73.94,36.19 73.28,36.19 67.23,42.25 66.71,42.25 U4.111 62.35,37.89 v62.33,37.89 | IC2.7 38.81,2.56 39.11,2.86 39.11,15.01 v39.43,15.33
  Bottom 0.152: v39.43,15.33 39.55,15.33 39.57,15.35 39.57,16.16 39.36,16.36 39.36,26.43 43.43,30.5 43.96,30.5 44.46,30 44.5,30 45.25,29.25 45.5,29.25 57.05,40.8 57.95,40.8 61.5,37.25 61.72,37.25 62.33,37.86 v62.33,37.89
BOOST_TC4
  Top 0.152: R51.1 24.8,9.45 25,9.25 33.25,9.25 33.53,9.53 33.53,11 | 33.53,11 U$13.G | IC2.6 34.91,3.83 34.28,4.47 34.28,10.64 33.92,11 33.53,11
BRV_CPU  (via drill 0.25)
  Top 0.127: C20.1 68.02,35.98 v67.48,35.98
  Top 0.152: U4.103 63.8,33.04 v63.8,32.8 63.47,32.47 63.47,32.28 R46.2 64.58,31.77 D11.A 66.91,34.09 D12.C
  Bottom 0.127: v67.48,35.98 64.3,32.8 v63.8,32.8
CAM_CPU
  Top 0.152: U4.114 66.4,44.06 66.9,44.06 71.58,39.39 72.28,39.39 77.19,44.3 78.13,44.3 79.96,42.47 80.79,42.47 84.13,45.81 91.15,45.81 91.5,45.46 91.5,40.92 91.33,40.75 90.65,40.75 90.5,40.6 90.5,40.25 | R54.1 90.41,37.18 U$10.5 94.01,37.18 94.24,37.41 94.24,39.69 93.68,40.25 90.5,40.25 | R65.1 90.2,39.8 89.75,40.25 90.5,40.25
CAN_H  (via drill 0.25)
  Top 0.152: U1.7 43,23.4 43,23.84 R24.2 v42.52,25.48 | v42.52,25.48 | v52.4,33.1 51.59,33.1 45,39.7 45,40.56 v44.31,41.25 | v20.24,72.53 20.53,72.82 25.2,72.82 25.2,72.83 33.71,72.83 34.06,73.18 34.06,76.81 34.59,77.34 36.09,77.34 36.25,77.5 v36.25,79.25 | v45.25,81.18 47.57,81.18 47.75,81 47.75,78.52 J3.33
  Bottom 0.152: v42.52,25.48 41.58,26.42 41.58,26.92 43.52,28.87 43.87,28.87 44.71,28.03 45.47,28.03 45.5,28 46.25,28 51.15,32.9 51.84,32.9 52.04,33.1 v52.4,33.1 | v44.31,41.25 44.29,41.25 42.32,43.22 17.45,43.22 17.16,43.5 17.16,70.41 17.5,70.75 19.13,70.75 19.5,71.12 19.5,72.5 19.75,72.75 20.02,72.75 v20.24,72.53 | v36.25,79.25 36.25,81.19 36.73,81.68 44.75,81.68 v45.25,81.18
CAN_L  (via drill 0.25)
  Top 0.152: U1.6 43.9,22.5 44.34,22.5 R24.1 v45.75,22.25 | v45.75,22.25 | v52.97,33.67 51.58,33.67 45.3,39.95 45.3,41.04 44.54,41.81 44.52,41.81 v44.27,42.06 | v44.86,82.69 49.81,82.69 50.18,82.32 J3.34
  Bottom 0.152: v45.75,22.25 46.25,22.75 46.25,23 42.5,26.75 42.5,27.25 43.5,28.25 44.06,28.25 45.06,27.25 45.93,27.25 51.28,32.6 51.97,32.6 52.04,32.67 52.17,32.55 52.63,32.55 52.97,32.89 v52.97,33.67 | v44.27,42.06 43.92,42.06 42.45,43.52 17.98,43.52 17.5,44 17.5,70 17.95,70.44 19.45,70.44 19.8,70.81 19.8,71.75 20.02,71.97 20.97,71.97 21.25,72.25 21.25,73.5 20.75,74 19.25,74 19,74.25 19,81.75 19.78,82.53 39.23,82.53 39.25,82.55 44.71,82.55 v44.86,82.69
CANRX
  Top 0.152: U4.65 45.37,24.45 45.37,24.15 46.91,22.61 46.91,22.14 41.27,16.5 41,16.5 U1.4
CANTX
  Top 0.152: U4.64 45.04,24.82 44.67,24.82 43.12,26.38 42.62,26.38 37,20.75 37,20.5 U1.1
CLT  (via drill 0.25)
  Top 0.152: C12.1 82,69.75 81.5,69.25 77,69.25 76.75,69 R42.2 77,68.05 D7.A D8.C 65.6,65.4 65.25,65.05 65.25,62.76 65.51,62.5 v65.94,62.5 | R78.2 33,29.25 33.25,29.5 34.25,29.5 34.67,29.92 v34.63,29.96
  Bottom 0.152: v34.63,29.96 34.89,29.96 41.91,36.98 42.93,36.98 43.92,37.97 43.92,38.52 66.55,61.15 66.55,61.89 v65.94,62.5
CLT_CPU  (via drill 0.25)
  Top 0.152: U3.9 33.02,23.23 33.25,23 34.08,23 34.29,23.22 U3.8 34.29,25.48 v34.32,25.5 | U4.29 40.52,40.06 40.73,40.06 41.29,39.5 v41.75,39.5
  Bottom 0.152: v34.32,25.5 34.06,25.75 34.06,26.25 33.74,26.57 33.74,30.99 41.75,39 v41.75,39.5
CLUTCH_CPU
  Top 0.152: R70.1 50.34,17.32 D19.C 52.09,20.41 D18.A 51.25,21.75 51.25,22 52,22.75 52,23.13 50.75,24.38 50.75,24.57 51.07,24.89 51.07,25.18 49.1,27.15 48.79,27.15 U4.66
CLUTCH_IN  (via drill 0.25)
  Top 0.152: D18.C 56.5,16.5 60.75,16.5 61.25,17 v61.25,20 | v77.08,30.81 77.12,30.85 77.12,30.89 79.26,30.89 79.75,31.38 79.75,35.51 78.63,36.62 v78.63,36.76 | v68.5,61.25 67.25,62.5 v66.75,62.5 | v52.75,72.25 52.75,75.75 53.06,76.06 60.54,76.06 60.59,76.01 v66.75,76.01 | v77.25,81 77.75,81 78,80.75 78,78.56 J4.21
  Bottom 0.152: v77.08,30.81 77.2,30.81 77.6,30.41 77.6,20.36 77.24,20 v61.25,20 | v68.5,61.25 69.23,61.25 71.06,59.42 71.06,57.15 80.75,47.46 80.75,46.21 82.5,44.46 82.5,38.5 82,38 78.75,38 78.63,37.88 v78.63,36.76 | v66.75,62.5 60.8,68.44 56.05,68.44 55.7,68.81 55.7,71.96 55.44,72.21 55.44,72.25 v52.75,72.25 | v66.75,76.01 68.26,76.01 68.5,76.25 68.5,80.5 69,81 v77.25,81
COOLANT_SENSOR
  Top 0.152: R43.1 R42.1 C11.1 74.25,70.45 74.25,78 73.8,78.45 J4.19
CRANK_CPU  (via drill 0.25)
  Top 0.152: U4.105 64.19,34.06 64.6,34.06 67.79,37.25 68.25,37.25 72.22,33.28 78.97,33.28 v79,33.25 | U$10.4 91.37,37.82 91.15,38.03 91.15,38.59 91,38.75 85.66,38.75 | 85.66,38.75 83.75,38.75 83.34,38.34 R64.1 83.11,37.5 81.5,37.5 81.06,37.06 v81.06,33.25 | R53.2 85.66,38.75
  Bottom 0.152: v79,33.25 v81.06,33.25
D_N
  Top 0.254: J1.2 7.91,35.4 8.03,35.52 9.79,35.52 10.05,35.27 R58.1
D_P
  Top 0.254: J1.3 7.91,36.05 8.03,35.93 9.75,35.93 10.04,36.22 R39.1
DIR  (via drill 0.25)
  Top 0.152: U4.110 66.69,41.53 67.34,41.53 73.87,35 74.39,35 84.21,44.81 87.19,44.81 v87.5,44.5
  Bottom 0.152: v87.5,44.5 87.5,67.75 88,68.25 93.14,68.25 STEPSTICK-X.DIR
FAN  (via drill 0.25)
  Top 0.152: Q2.3 81.5,46.38 v81.5,46.25 | v54,72.89 53.5,73.39 53.5,75 53.75,75.25 60.06,75.25 v60.31,75.5 | v61.5,82.39 63.56,82.39 63.79,82.62 80.27,82.62 v81,81.88 | v92.91,81.55 92.91,78.47 J4.27
  Bottom 0.152: v81.5,46.25 81.75,46.5 81.75,46.89 71.36,57.27 71.36,59.55 61.47,69.44 57.8,69.44 57.17,70.07 57.17,72.83 57,73 54,73 v54,72.89 | v60.31,75.5 60.31,82.06 60.64,82.39 v61.5,82.39 | v81,81.88 81.12,82 92.46,82 v92.91,81.55
FAN_CPU
  Top 0.152: U4.115 66.3,44.67 66.78,44.67 71.29,40.16 71.72,40.16 74.33,42.76 R50.2
FUEL  (via drill 0.25)
  Top 0.152: Q1.3 78.41,51.2 78.85,51.2 80.65,53 v80.75,53 | v48.5,86.62 48.08,86.62 48.06,86.64 15.72,86.64 15.25,86.17 v15.25,80.75
  Bottom 0.152: v80.75,53 80.98,53.23 80.98,53.65 62.62,72 60.17,72 59.75,72.42 59.75,86.13 59.24,86.64 48.52,86.64 v48.5,86.62 | v15.25,80.75 15.25,78.52 J3.20
FUEL_CPU
  Top 0.152: U4.116 66.17,45.24 66.66,45.24 69.84,42.06 70.3,42.06 72.55,44.31 R72.2
GND  (via drill 0.25)
  Top 0.127: U4.107 63.53,36.13 62.87,36.13 62.38,36.13 62,35.75 v61.75,35.75 | R63.1 81.41,32.66 81.52,32.77 84.23,32.77 v84.47,32.53 | LED22.C 104.3,5 v102.75,5 | U$26.3 100.61,9.13 100.25,9.5 v100.25,10.25 | LED3.C v70.25,18.5 | C30.1 66.25,19 v65.75,18.5 | R11.2 109.18,39.88 U$8.S 108.72,41.97 108.5,41.75 108,42.25 108,43.85 v108.15,44 | U$10.11 96.7,36.55 96.5,36.75 96.5,37.5 96.75,37.75 97.62,37.75 U$10.13 | U$10.6 93.2,36.55 93.5,36.25 93.5,35.5 93.25,35.25 92.34,35.25 U$10.8 | U$10.1 93.28,39.72 93.5,39.5 93.5,38.75 93.2,38.45 U$10.3 92.99,38.45 v93.68,37.77 | v106.73,44 106.73,45.32 C4.2
  Top 0.152: U4.134 56.68,48.49 v56.68,48.57 | v104.75,33.5 104.66,33.59 C24.2 104.66,37.34 104.5,37.5 102.25,37.5 101.88,37.13 C23.2 C22.2 | v106.73,40.25 105,40.25 104.75,40.5 v104.75,40.75 | U$9.3 86.61,28.64 v86.75,28.5 | v86.75,30 86.5,30.25 v86.5,32.51 | U4.6 49,47.84 v49,47.25 | U4.18 44.5,43.85 | 44.5,43.85 44.52,43.84 44.52,44.55 U4.17 | 44.5,43.85 v44.5,43 | U4.93 60.25,29.52 v60.25,29.5 60.25,29 R47.1 | U4.71 50.17,25 v50.25,25 | U4.44 38.25,32.17 v38.25,32 | U4.121 62.16,44.77 v62.27,44.77 | U5.2 18.26,34.16 18.26,34.15 17.97,33.86 v17.97,33.7 | C32.2 19.36,30.36 v19.25,30.25 | C29.1 17.86,37.25 v18.75,37.25 | R79.1 29.56,28.2 v29.37,28.01 | v30.5,23 30.48,23.02 U3.11 | R105.2 v100,16.25 | v103,16 103.25,16.25 LED20.C | C33.1 77.2,26.8 76.63,27.37 75.85,27.37 75.84,27.38 73.12,27.38 v73,27.5 | U$11.3 73.73,21.73 73.41,21.41 v71.75,21.41 | R12.1 73.25,33.75 74.26,33.75 74.35,33.66 76.33,33.66 v76.5,33.83 | C20.2 71.5,32.5 v75.25,32.5 | D12.A v70.75,30.5 | v70.75,30.5 | U$12.S 109.18,20.82 v109,21 | R3.2 109.26,14.01 v109,13.75 | FL2.2 39.25,46.25 v38.5,47 | R125.1 14.2,14.25 v12.5,14.25 | R91.2 15.27,10.82 U$22.S | U4.57 43.5,28.23 43.5,27.25 v44,26.75 | v35.25,26.75 36.08,25.92 R2.1 | R108.1 97.15,12.25 | 97.15,12.25 91.25,12.25 90.86,11.86 90.86,10.63 90.35,10.12 90.35,4.9 90.75,4.5 v92.5,4.5 | v100.25,10.25 100.25,10.75 100.69,11.19 v101.69,11.19 | v102.81,11.25 102.75,11.31 v102.75,12.81 | v97.15,12.86 97.15,12.25
  Top 0.305: C48.2 13.39,59.55 v13.44,59.5 | v13,57.39 13,56.62 U$27.TAB 16.35,50.75 v10,50.75 | R16.1 77.92,41.67 | 77.92,41.67 R4.1 | R9.1 81.5,40.5 v81.5,40.75 | 77.92,41.67 75,38.75 v75,38.5 | v80.5,43.75 79.86,44.39 Q2.2
  Bottom 0.127: v84.47,32.53 84.41,32.47 84.41,32.36 84.77,32.01 86,32.01 v86.5,32.51 | v108.15,44 v106.73,44
  Bottom 0.152: v106.73,44 v106.73,40.25 | v86.75,28.5 v86.75,30 | v29.37,28.01 29.37,25.13 30.5,24 v30.5,23 | v100,16.25 100.25,16 v103,16 | v73,27.5 71.5,27.5 v71.25,27.25 71.25,30 v70.75,30.5 | v38.25,32 36.25,30 35.5,30 34.5,29 34.5,28 35.25,27.25 v35.25,26.75 | v101.69,11.19 101.76,11.25 v102.81,11.25 | v102.75,12.81 102.7,12.86 v97.15,12.86 | v76.5,33.83 76.5,32.75 76.25,32.5 v75.25,32.5
  Bottom 0.305: v13.44,59.5 13,59.06 v13,57.39 | v75,38.5 80.25,43.75 v80.5,43.75
  pour Top: 0,92.5 0,0 120,0 120,92.5
  pour Bottom: 0,92.5 0,0 120,0 120,92.5
HALL1  (via drill 0.25)
  Top 0.152: R52.2 85.45,41.85 R53.1 85.74,41.93 v85.74,43.49 | v48.57,85.79 48.55,85.82 17.23,85.82 16.5,85.09 v16.5,81.25
  Bottom 0.152: v85.74,43.49 85.74,45.74 73.21,58.27 73.21,60.29 62.11,71.39 59.36,71.39 59,71.75 59,81.66 58.64,82.02 58.64,85.5 58.18,85.96 48.74,85.96 v48.57,85.79 | v16.5,81.25 16.5,77.5 16.75,77.25 17.5,77.25 17.75,77 17.75,75.52 J3.4
HALL2  (via drill 0.25)
  Top 0.152: R54.2 88.02,35.57 R55.2 88,33.72 87.39,33.12 82.25,33.12 81.75,33.62 v81.75,36.75 | v47.75,76.76 47.75,76.9 47.49,77.16 44.13,77.16 43.96,77 35.5,77 35,76.5 35,75.63 J3.11
  Bottom 0.152: v81.75,36.75 83.12,36.75 83.5,37.13 83.5,46.5 72.28,57.72 72.28,59.93 61.76,70.44 58.7,70.44 58.09,71.06 58.09,75.71 57.72,76.08 51.45,76.08 50.77,76.76 v47.75,76.76
HC1  (via drill 0.25)
  Top 0.152: U$3.D 52.25,7.42 52.45,7.62 v54.55,7.62 | v109,74.31 105.69,74.31 105.39,74.61 J4.15
  Top 0.508: R143.2 47.43,1.8 D27.A 50.21,1.48 U$3.D 49.82,5.95 LED17.C
  Bottom 0.152: v54.55,7.62 55.03,7.62 55.61,8.2 113.47,8.2 114.44,9.17 114.44,74.06 114.1,74.4 109.09,74.4 v109,74.31
HC1_CPU  (via drill 0.25)
  Top 0.152: R6.2 65.41,49.16 65.04,49.16 62.45,51.75 62.07,51.75 U4.131 55.59,45.27 v55.52,45.27 | IC2.9 39.7,1.29 39.41,1.59 39.41,14.34 40.29,15.22 40.29,15.39 v40.27,15.41 | v56.14,38.86 v55.23,39.77
  Bottom 0.152: v40.27,15.41 40.24,15.45 40.24,15.97 39.67,16.54 39.67,26.3 43.56,30.19 43.84,30.19 45.09,28.95 45.88,28.95 51.93,35 52.64,35 56.25,38.61 56.25,38.75 v56.14,38.86 | v55.52,45.27 55.52,45.25 55.5,45.25 52.82,42.57 52.82,42.18 v55.23,39.77
HC1_TC4  (via drill 0.25)
  Top 0.152: U$3.G 54.53,9.78 54.25,9.5 45.8,9.5 45.55,9.75 R18.1 45.25,11.05 v43.87,11.05 v43.86,11.04 | IC2.10 40.22,2.56 39.97,2.82 39.97,10.02 v40.01,10.06
  Bottom 0.152: v40.01,10.06 40.01,10.9 40.34,11.23 43.59,11.23 43.78,11.04 v43.86,11.04
HC2  (via drill 0.25)
  Top 0.152: U$2.D 63.5,7.25 63.74,7.49 v65.76,7.49
  Top 0.508: R141.2 58.68,1.8 D26.A 61.46,1.48 U$2.D 63.5,3.79 61.59,5.7 LED16.C
  Bottom 0.152: v65.76,7.49 65.76,7.66 65.96,7.87 113.8,7.87 114.75,8.81 114.75,74.84 114.34,75.25 112,75.25 111.75,75.5 111.75,76.25 111.5,76.5 108.08,76.5 107.89,76.69 J4.33
HC2_CPU  (via drill 0.25)
  Top 0.152: R7.2 67.95,45.7 67.57,45.7 62.68,50.59 62.33,50.59 U4.129 57.31,45.56 v56.27,44.52 | IC2.11 42.68,3.9 40.93,3.9 40.65,4.18 40.65,14.37 41.04,14.76 v41.04,15.12 | v57.28,39.89 56.39,40.77 v56.23,40.77
  Bottom 0.152: v41.04,15.12 41.04,15.63 39.97,16.7 39.97,26.18 43.47,29.68 43.92,29.68 44.96,28.64 46,28.64 51.13,33.77 51.84,33.77 57.56,39.49 57.56,39.66 57.34,39.89 v57.28,39.89 | v56.23,40.77 54.5,42.5 54.5,43 56.02,44.52 v56.27,44.52
HC2_TC4  (via drill 0.25)
  Top 0.152: R20.1 57.05,9.7 57.25,9.5 65.5,9.5 65.78,9.78 65.78,10.5 | 65.78,10.5 U$2.G | IC2.12 44.1,5.11 44.25,5.25 44.25,6.75 44.5,7 50.25,7 50.5,7.25 50.5,8.51 50.82,8.83 67.16,8.83 67.52,9.2 77.92,9.2 78.24,9.51 78.24,10.8 v78.32,10.89 | v64.5,11 64.5,10.75 64.75,10.5 65.78,10.5
  Bottom 0.152: v78.32,10.89 78.32,10.94 64.56,10.94 v64.5,11
IAT  (via drill 0.25)
  Top 0.152: R76.2 27,12.75 27.25,12.5 27.61,12.5 v27.75,12.64 | v111.98,12.27 112.38,12.66 v112.38,13.75 | v103.25,68.96 101.21,71 90.75,71 90.25,70.5 90.25,66 89.9,65.65 D5.A D6.C | D6.C 82.45,65.65 C10.1 | R40.2 84.5,68.05 D6.C
  Bottom 0.152: v27.75,12.64 28.14,12.25 111.97,12.25 v111.98,12.27 | v112.38,13.75 112.38,22.09 111.87,22.59 111.87,23.64 112.62,24.38 112.62,25.58 112.25,25.95 111.56,25.95 111.29,25.68 110.83,25.68 110.5,26 110.5,26.75 110.5,71 110,71.5 105.6,71.5 105.01,70.91 105.01,70.72 v103.25,68.96
IAT_CPU  (via drill 0.25)
  Top 0.152: U3.1 26.67,19.42 27,19.75 27.75,19.75 v27.88,19.62 28,19.5 28,18.55 U3.2 | v40.5,39.5 40.37,39.5 U4.30
  Bottom 0.152: v27.88,19.62 27.88,22.07 28.16,22.36 32.08,22.36 32.59,22.86 32.59,35.87 38.11,41.4 38.53,41.4 40.43,39.5 v40.5,39.5
IAT_SENSOR
  Top 0.152: R41.1 C9.1 R40.1 84.25,72.5 84,72.75 81.83,72.75 81.46,73.11 81.46,78.34 81.31,78.5 80.44,78.5 J4.22
IDLE  (via drill 0.25)
  Top 0.152: U$5.D 75,6.96 75.34,7.3 v77.5,7.3 | v113,76.27 111.06,76.27 110.83,76.5 98.5,76.5 97.89,77.11 J4.29
  Top 0.508: R145.2 70.18,1.8 D28.A 72.96,1.48 U$5.D 72.32,6.2 LED18.C
  Bottom 0.152: v113,76.27 113.23,76.5 114.75,76.5 115.25,76 115.25,64.03 115.09,63.87 115.09,16.88 115.25,16.72 115.25,7.74 114.63,7.12 77.68,7.12 v77.5,7.3
IDLE_CPU  (via drill 0.25)
  Top 0.152: R9.2 74.97,33.97 74.47,33.97 67.46,40.98 66.86,40.98 U4.109 63.32,37.44 v63.03,37.44 | IC2.14 41.28,7.64 41.24,7.69 41.24,13.82 41.62,14.2 41.62,15.75 41.54,15.83 v41.54,15.9
  Bottom 0.152: v41.54,15.9 41.39,16.06 41.37,16.06 40.28,17.16 40.28,26.05 43.59,29.37 43.8,29.37 44.83,28.34 46.13,28.34 51,33.21 51.72,33.21 57.69,39.18 59.14,39.18 61.9,36.42 62.11,36.42 63.03,37.35 v63.03,37.44
IDLE_TC4
  Top 0.152: U$5.G 77.28,9.78 77,9.5 68.5,9.5 68.3,9.7 R38.1 67,11 66.75,10.75 66.75,9.25 66.68,9.18 43.01,9.18 IC2.15
IGN1  (via drill 0.25)
  Top 0.152: J3.17 50.25,75.38 50.25,73.75 50.56,73.44 v51.25,73.44 | v79.69,36.75 80.19,36.25 80.19,30.88 79.81,30.5 77.59,30.5 77.28,30.19 72.8,30.19 72.43,29.83 72.43,26.67 72.79,26.32 74.72,26.32 R68.2
  Bottom 0.152: v51.25,73.44 57.06,73.44 57.48,73.02 57.48,70.46 58.19,69.75 61.59,69.75 71.67,59.68 71.67,57.47 73.69,55.44 73.69,55.37 82.89,46.18 82.89,37.96 82.54,37.61 80.02,37.61 79.69,37.29 v79.69,36.75
IGN1_CPU  (via drill 0.25)
  Top 0.152: U$9.2 86.47,27.36 86.69,27.14 86.69,25 86.44,24.75 85,24.75 84.75,24.5 R30.2 R66.1 81.5,23.45 81.31,23.25 81.31,19.48 81.08,19.25 78.25,19.25 78,19.5 78,24.25 77.75,24.5 v76.25,24.5 | U4.97 60.49,32.08 61.66,30.91 v61.66,30.77 v61.67,30.76
  Bottom 0.152: v76.25,24.5 65,24.5 60.96,28.54 60.96,28.96 62.17,30.17 62.17,30.26 v61.67,30.76
IGN2  (via drill 0.25)
  Top 0.152: v80.5,37 80.5,30.75 80.75,30.5 82.06,30.5 82.43,30.13 82.43,25.51 81.98,25.05 81.15,25.05 81,24.91 81,21.25 80.75,21 79.85,21 R67.2
  Bottom 0.152: J3.13 40.18,74.32 40.5,74 57.25,74 57.78,73.47 57.78,70.76 58.4,70.14 61.63,70.14 71.97,59.8 71.97,57.59 74,55.57 74,55.5 83.19,46.3 83.19,37.59 82.91,37.31 80.81,37.31 v80.5,37
IGN2_CPU  (via drill 0.25)
  Top 0.127: R63.2 83.31,30.44 83.75,30 85.16,30 85.25,29.91
  Top 0.152: 85.25,29.91 U$9.4 85.1,29.57 85.42,29.25 87.25,29.25 87.5,29 87.5,23.95 R31.2 | R63.2 83,31.33 v83,26.5 | v78.25,25.25 76.31,25.25 v76.25,25.31 | v62.26,31.33 61.97,31.33 U4.98
  Bottom 0.152: v83,26.5 83,25.47 82.78,25.25 v78.25,25.25 | v76.25,25.31 65.19,25.31 62,28.5 62,29 63,30 63,30.59 v62.26,31.33
IGN3  (via drill 0.25)
  Top 0.152: v64.53,15.71 64.55,15.73 67.58,15.73 67.75,15.56 R36.2 | v22.82,40.25 22.31,40.75 22.31,44.25 v22.82,44.75 | v19.56,77.23 15.48,77.23 15.18,76.93 J3.3
  Bottom 0.152: v64.53,15.71 64.52,15.72 63.45,15.72 63.19,15.47 63.19,14.5 63,14.3 50.49,14.3 49.88,14.92 46.99,14.92 46.64,14.57 46.64,13.45 46.41,13.21 28.83,13.21 28.23,13.81 27.2,13.81 26.39,13 16.5,13 16.3,13.2 16.3,18.5 16.5,18.7 17.63,18.7 18.05,19.12 18.05,20.95 17.82,21.18 17,21.18 16.86,21.32 16.86,39.05 17.25,39.45 21.78,39.45 21.78,39.44 22.24,39.44 22.57,39.77 22.57,40 v22.82,40.25 | v22.82,44.75 22.82,45.43 22.5,45.75 19.5,45.75 19,46.25 19,62.92 19.22,63.14 19.22,63.96 18.41,64.77 18.41,67.61 18.75,67.94 23.8,67.94 24.25,67.5 24.25,66.25 24.5,66 26.5,66 26.75,66.25 26.75,68.75 26.25,69.25 24,69.25 23.75,69.5 23.75,76.5 23.02,77.23 v19.56,77.23
IGN3_CPU  (via drill 0.25)
  Top 0.152: v63.5,24 70.61,24 70.85,23.75 70.85,21.18 71.17,20.86 72.25,20.86 | 72.25,20.86 U$11.2 | 72.25,20.86 R120.2 R34.1 | v57.25,31 57.34,31 U4.91
  Bottom 0.152: v63.5,24 63.25,24 57.25,30 v57.25,31
IGN4  (via drill 0.25)
  Top 0.152: R35.2 63.75,19.6 v63.75,14.5 | v22.01,40 v22.01,44.75 | v24.75,68.19 v24.75,71
  Bottom 0.152: v63.75,14.5 63.25,14 50.36,14 49.75,14.61 47.33,14.61 46.95,14.23 46.95,13.2 46.66,12.9 28.7,12.9 28.11,13.5 27.32,13.5 26.51,12.7 16.3,12.7 16,13 16,18.75 16.25,19 17.5,19 17.75,19.25 17.75,20.61 17.48,20.88 16.68,20.88 16.55,21 16.55,39.55 16.75,39.75 21.76,39.75 v22.01,40 | v22.01,44.75 22.01,44.99 21.55,45.45 19.05,45.45 18.5,46 18.5,62.85 18.92,63.27 18.92,63.83 18.11,64.64 18.11,68.11 18.25,68.25 24.69,68.25 v24.75,68.19 | v24.75,71 24.75,71.75 25.25,72.25 30,72.25 30.25,72.5 30.25,75.38 J3.9
IGN4_CPU  (via drill 0.25)
  Top 0.152: v63.75,24.81 64.25,24.31 71.23,24.31 71.44,24.1 71.44,23.59 71.65,23.38 73.72,23.38 U$11.4 76.36,23.39 76.5,23.25 R121.2 75.36,22.2 75.2,22.04 75.2,18.75 75.45,18.5 76.5,18.5 76.75,18.25 R33.2 | v57.82,31.57 57.82,31.24 U4.92
  Bottom 0.152: v63.75,24.81 57.82,30.74 v57.82,31.57
IGN5  (via drill 0.25)
  Top 0.152: JP15.2 98.23,18.27 98.75,17.75 98.75,15.5 99.25,15 100.08,15 v100.25,15.17 | v108,65 108,73 108.25,73.25 110.25,73.25 110.5,73.5 110.5,75.34 J4.17
  Bottom 0.152: v100.25,15.17 106.87,15.17 107.19,15.5 107.19,22.84 106.89,23.14 106.89,23.86 107.14,24.11 107.14,25.64 107.86,26.36 109.43,26.36 109.59,26.52 109.59,64.75 109.34,65 v108,65
IGN5_CPU  (via drill 0.25)